# EAGLE design numi_clock (EAGLE 7.4.0)
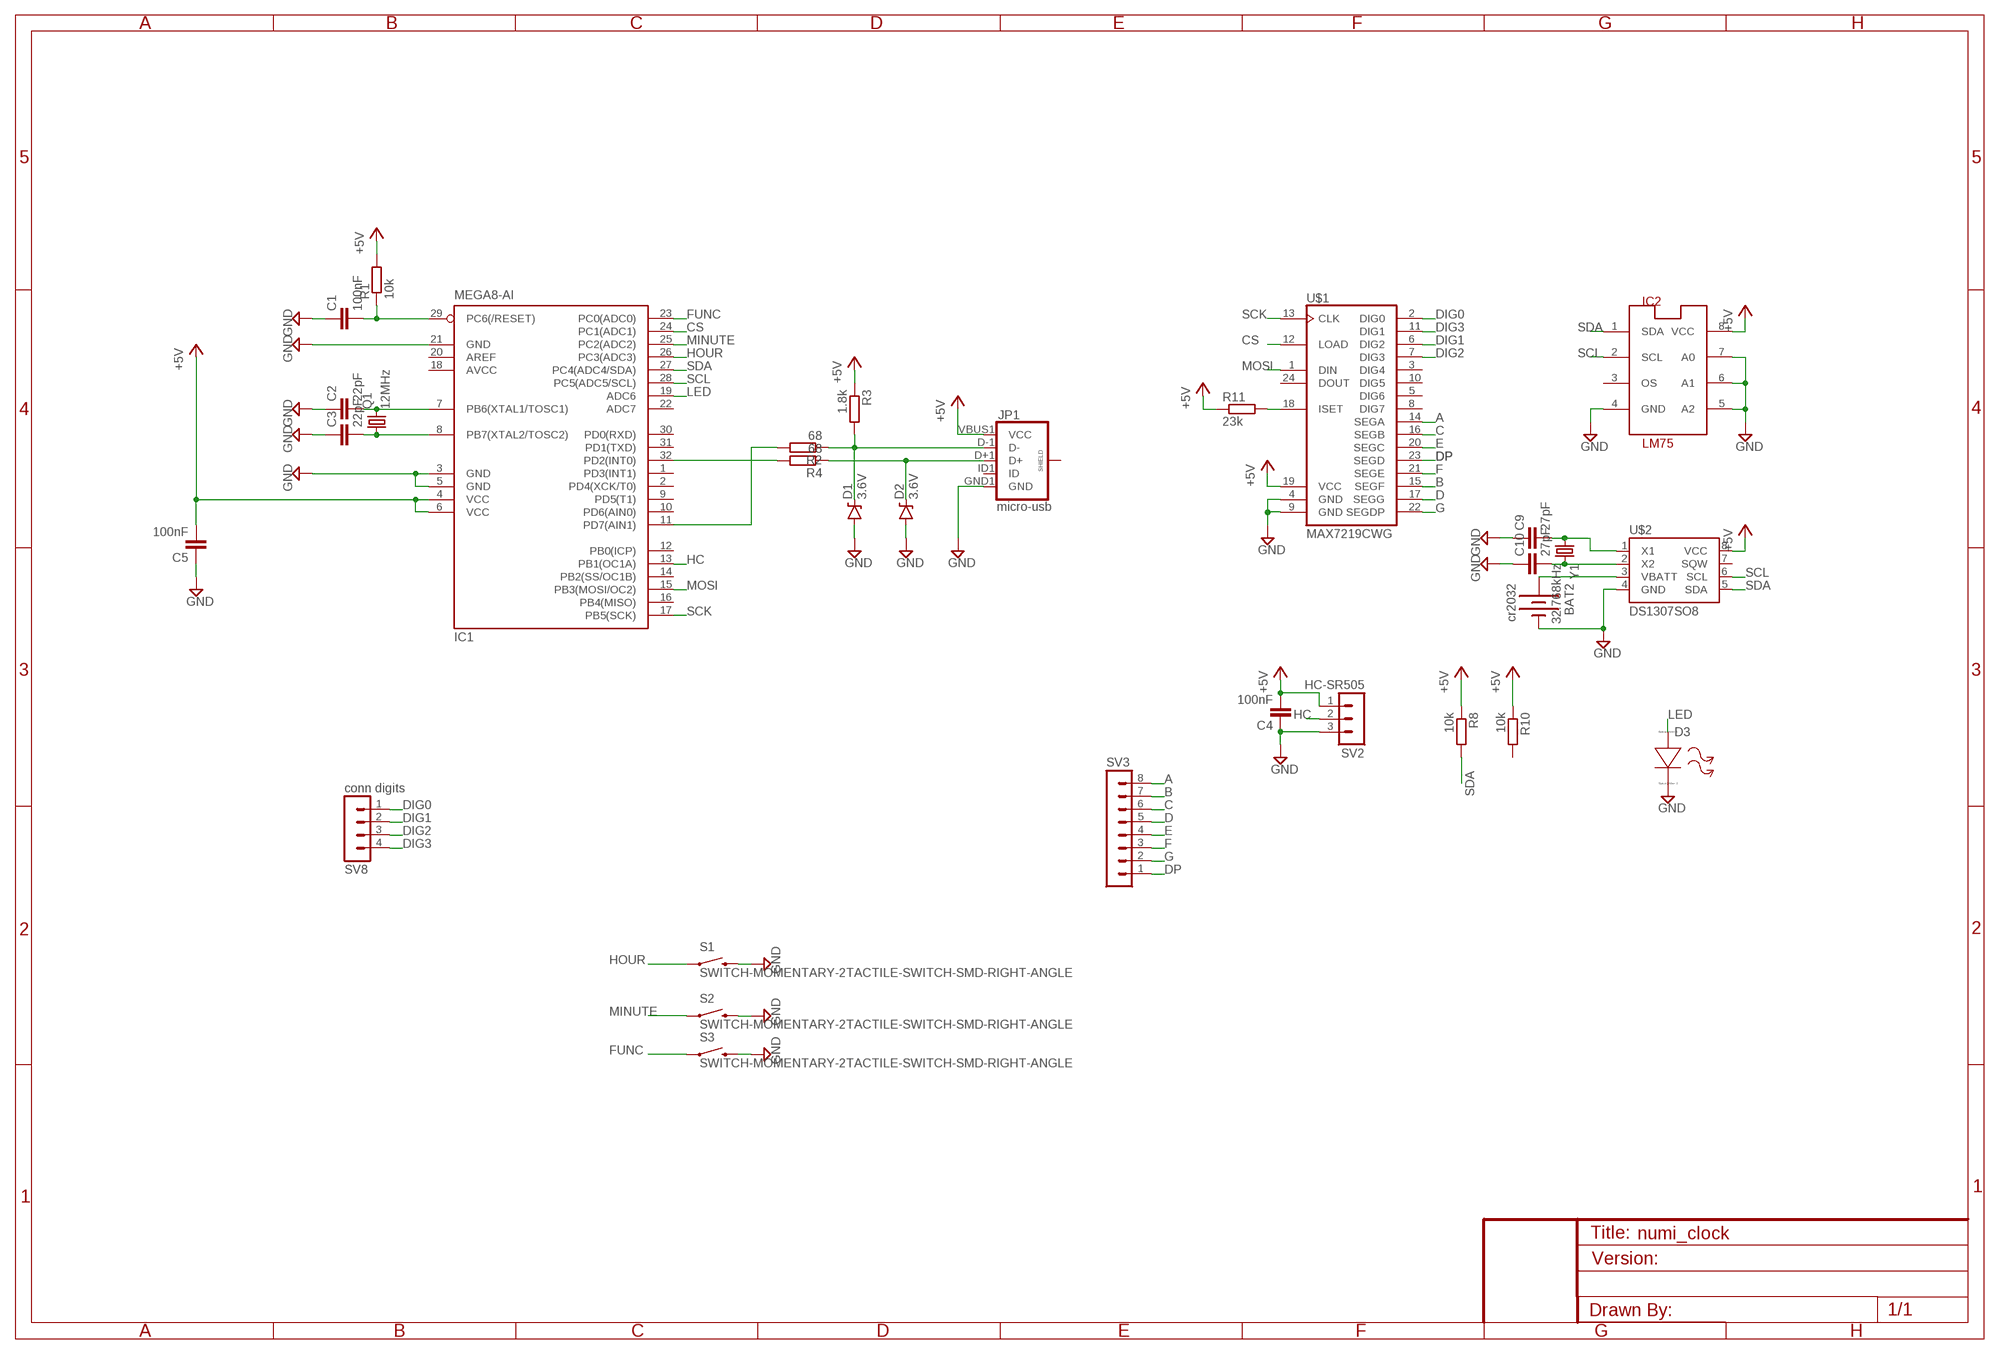
[diagram p0: schematic, sheet 1]

## Parts
BAT2  cr2032  BATTERY20PTH  [BATTCOM_20MM_PTH]
C1  100nF  C-EUC0805  [C0805]
C2  22pF  C-EUC0805  [C0805]
C3  22pF  C-EUC0805  [C0805]
C4  100nF  C-EUC0805  [C0805]
C5  100nF  C-EUC0805  [C0805]
C9  27pF  C-EUC0805  [C0805]
C10  27pF  C-EUC0805  [C0805]
D1  3.6V  DIODE-ZENER3.3V  [SOD-323]
D2  3.6V  DIODE-ZENER3.3V  [SOD-323]
D3  LED  [R0805]
IC1  MEGA8-AI  [TQFP32-08]
IC2  LM75  LM75_ICN  [SO8_LM75]
JP1  micro-usb  USB_MICROB_PLUGCONN-11752  [USB-B-MICRO-SMD_V03]
Q1  12MHz  CRYSTALCTS406  [CTS406]
R1  10k  R-EU_R0805  [R0805]
R2  68  R-EU_R0805  [R0805]
R3  1.8k  R-EU_R0805  [R0805]
R4  68  R-EU_R0805  [R0805]
R8  10k  R-EU_R0805  [R0805]
R10  10k  R-EU_R0805  [R0805]
R11  23k  R-EU_R0805  [R0805]
S1  SWITCH-MOMENTARY-2TACTILE-SWITCH-SMD-RIGHT-ANGLE  [TACTILE_SWITCH-SMD-RIGHT-ANGLE]
S2  SWITCH-MOMENTARY-2TACTILE-SWITCH-SMD-RIGHT-ANGLE  [TACTILE_SWITCH-SMD-RIGHT-ANGLE]
S3  SWITCH-MOMENTARY-2TACTILE-SWITCH-SMD-RIGHT-ANGLE  [TACTILE_SWITCH-SMD-RIGHT-ANGLE]
SV2  HC-SR505  MA03-1  [MA03-1]
SV3  MA08-1  [MA08-1]
SV8  conn digits  MA04-1  [MA04-1]
U$1  MAX7219CWG  [SO24L]
U$2  DS1307SO8  [SO08]
Y1  32.768kHz  CRYSTALTC26H  [TC26H]

## Nets
+5V: C4.2 C5.2 IC1.4(VCC) IC1.6(VCC) IC2.8(VCC) JP1.VBUS1(VCC) R1.2 R3.1 R8.1 R10.1 R11.1 SV2.1 U$1.19(VCC) U$2.8(VCC)
A: SV3.8 U$1.14(SEGA)
B: SV3.7 U$1.15(SEGF)
C: SV3.6 U$1.16(SEGB)
CS: IC1.24(PC1(ADC1)) U$1.12(LOAD)
D: SV3.5 U$1.17(SEGG)
DIG0: SV8.1 U$1.2(DIG0)
DIG1: SV8.2 U$1.6(DIG2)
DIG2: SV8.3 U$1.7(DIG3)
DIG3: SV8.4 U$1.11(DIG1)
DP: SV3.1 U$1.23(SEGD)
E: SV3.4 U$1.20(SEGC)
F: SV3.3 U$1.21(SEGE)
FUNC: IC1.23(PC0(ADC0)) S3.1
G: SV3.2 U$1.22(SEGDP)
GND: BAT2.2(-) C1.1 C2.1 C3.1 C4.1 C5.1 C9.1 C10.1 D1.A D2.A D3.2(-) IC1.3(GND) IC1.5(GND) IC1.21(GND) IC2.4(GND) IC2.5(A2) IC2.6(A1) IC2.7(A0) JP1.GND1(GND) S1.2 S2.2 S3.2 SV2.3 U$1.4(GND) U$1.9(GND) U$2.4(GND)
HC: IC1.13(PB1(OC1A)) SV2.2
HOUR: IC1.26(PC3(ADC3)) S1.1
LED: D3.1(+) IC1.19(ADC6)
MINUTE: IC1.25(PC2(ADC2)) S2.1
MOSI: IC1.15(PB3(MOSI/OC2)) U$1.1(DIN)
N$1: C2.2 IC1.7(PB6(XTAL1/TOSC1)) Q1.3
N$2: C3.2 IC1.8(PB7(XTAL2/TOSC2)) Q1.1
N$3: R11.2 U$1.18(ISET)
N$4: C9.2 U$2.1(X1) Y1.1
N$5: C10.2 U$2.2(X2) Y1.2
N$6: BAT2.1(+) U$2.3(VBATT)
N$7: D2.C JP1.D+1(D+) R4.1
N$8: D1.C JP1.D-1(D-) R2.1 R3.2
N$9: IC1.32(PD2(INT0)) R4.2
N$10: IC1.11(PD7(AIN1)) R2.2
RESET: C1.2 IC1.29(PC6(/RESET)) R1.1
SCK: IC1.17(PB5(SCK)) U$1.13(CLK)
SCL: IC1.28(PC5(ADC5/SCL)) IC2.2(SCL) U$2.6(SCL)
SDA: IC1.27(PC4(ADC4/SDA)) IC2.1(SDA) R8.2 U$2.5(SDA)
Unconnected: IC1.1(PD3(INT1)) IC1.2(PD4(XCK/T0)) IC1.9(PD5(T1)) IC1.10(PD6(AIN0)) IC1.12(PB0(ICP)) IC1.14(PB2(SS/OC1B)) IC1.16(PB4(MISO)) IC1.20(AREF) IC1.22(ADC7) IC1.30(PD0(RXD)) IC1.31(PD1(TXD)) IC2.3(OS) JP1.ID1(ID) JP1.SHIELD1(SHIELD) JP1.SHIELD2(SHIELD) JP1.SHIELD3(SHIELD) R10.2 U$1.3(DIG4) U$1.5(DIG6) U$1.8(DIG7) U$1.10(DIG5) U$1.24(DOUT) U$2.7(SQW)

## Power pins joined to a net without a drawn wire
AVCC: IC1.18(AVCC)

## Library data of the parts
BAT2 = SparkFun:BATTERY: Battery Holders Various common sizes : AA, AAA, 20mm coin cell and 12mm coin cell.
C1-C5 C9 C10 = rcl:C-EU: CAPACITOR, European symbol
D1 D2 = SparkFun-DiscreteSemi:DIODE-ZENER: Zener Diode Production Part - 8199 3.4V Zener Voltage; PROD_ID: DIO-11284; VALUE: 3.3V
D3 = sym:LED: Light Emitting Diode; SPICEMODEL: NONE; SPICETYPE: diode
IC1 = atmel:MEGA8: MICROCONTROLLER 8 Kbytes FLASH, 1 kbytes SRAM, 512 bytes EEPROM, USART, 6-channel 10 bit ADC, 2-channel 8 bit ADC Pin compatible with Atmega48, ATMega88, ATMega168 Source: avr.lbr; MPN: ATMEGA8-16AU; OC_FARNELL: 9171371; OC_NEWARK: 73M8863
IC2 = lm75:LM75_IC: Temperatursensor
JP1 = SparkFun-Connectors:USB_MICROB_PLUG: USB Micro-B connectors Some male, some female. Watch your step!; PROD_ID: CONN-11752
Q1 = crystal:CRYSTAL: CRYSTAL; OC_FARNELL: unknown; OC_NEWARK: unknown
R1-R4 R8 R10 R11 = rcl:R-EU_: RESISTOR, European symbol
S1-S3 = SparkFun-Electromechanical:SWITCH-MOMENTARY-2: Various NO switches- pushbuttons, reed, etc; PROD_ID: COMP-12265
SV2 = con-lstb:MA03-1: PIN HEADER; OC_FARNELL: unknown; OC_NEWARK: unknown
SV3 = con-lstb:MA08-1: PIN HEADER; OC_FARNELL: unknown; OC_NEWARK: unknown
SV8 = con-lstb:MA04-1: PIN HEADER; OC_FARNELL: unknown; OC_NEWARK: unknown
U$1 = max7219:MAX7219CWG
U$2 = SparkFun-FreqCtrl:DS1307: I2C real-time clock with battery backup.
Y1 = SparkFun-FreqCtrl:CRYSTAL: Various standard crystals. Proven footprints.; PROD_ID: XTAL-10112

## Board
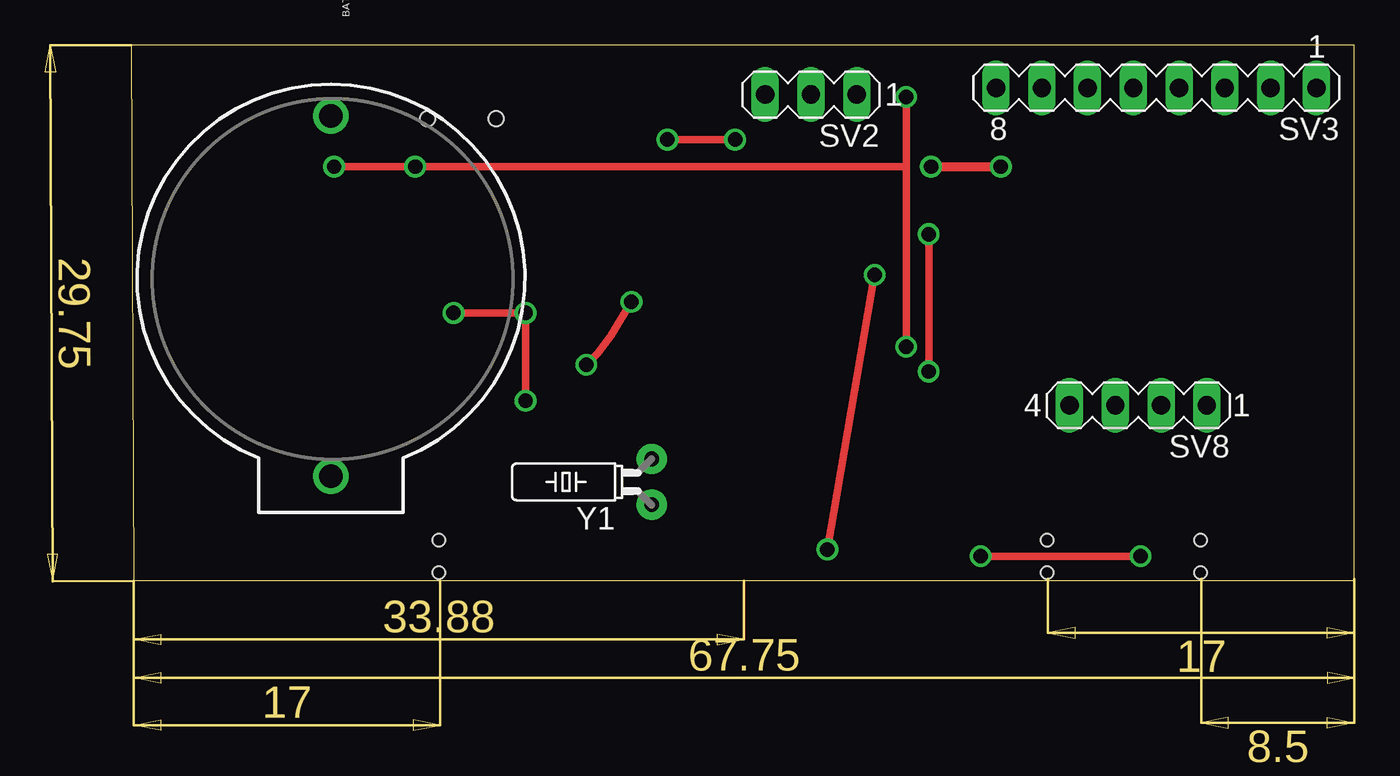
[diagram p1: board, top side]
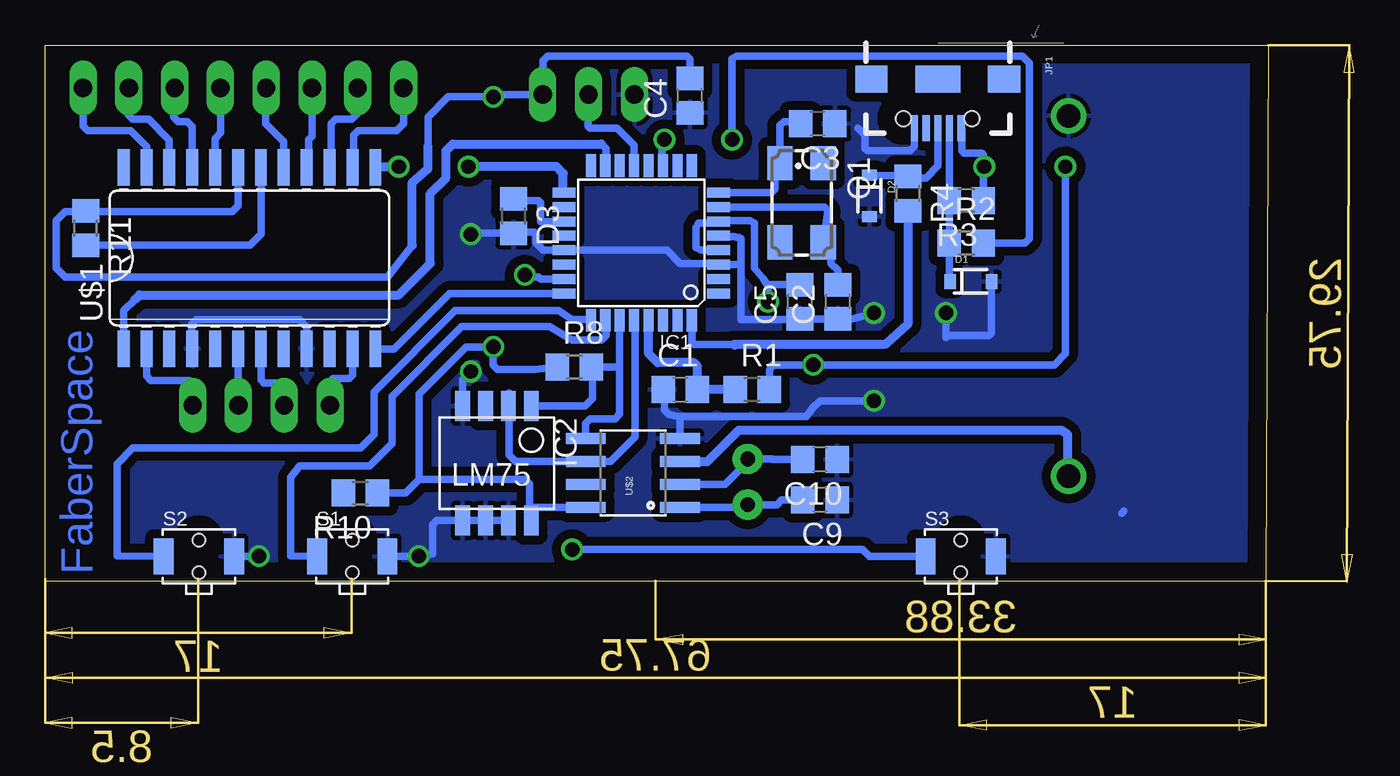
[diagram p2: board, bottom side, seen from below]

Size 67.88 x 29.75 mm. Coordinates in mm from the lower left corner, seen from the top.
Outline: 67.88,0 67.88,29.75 0,29.75 0.12,0 67.88,0
Copper layers (1*16): Top 0.035mm / dielectric 1.5mm / Bottom 0.035mm
Design rules "default": minimum track width 10mil, minimum drill 24mil, track to track 8mil, track to pad 8mil, pad to pad 8mil, via to via 8mil, smd to smd 8mil, copper to edge 40mil, drill to drill 8mil, minimum pad ring 10mil, minimum via ring 8mil, stop-mask expansion 4mil, vias tented up to drill 0mil, thermal gap 10mil

### Footprints (pad centres in the part's own frame; a part is rotated, then mirrored left to right if it is on the bottom)
BATTCOM_20MM_PTH = drill 1.3: 1 20,0; 2 0,0
C0805 = smd 1.3 x 1.5: 1 -0.95,0; 2 0.95,0
SOD-323 = smd 0.63 x 0.83: A 1.15,0; C -1.15,0
R0805 = smd 1.3 x 1.5: 1 -0.95,0; 2 0.95,0
TQFP32-08 = smd 1.27 x 0.559: 1 -4.293,2.8; 2 -4.293,2; 3 -4.293,1.2; 4 -4.293,0.4; 5 -4.293,-0.4; 6 -4.293,-1.2; 7 -4.293,-2; 8 -4.293,-2.8; 17 4.293,-2.8; 18 4.293,-2; 19 4.293,-1.2; 20 4.293,-0.4; 21 4.293,0.4; 22 4.293,1.2; 23 4.293,2; 24 4.293,2.8 | smd 0.559 x 1.27: 9 -2.8,-4.293; 10 -2,-4.293; 11 -1.2,-4.293; 12 -0.4,-4.293; 13 0.4,-4.293; 14 1.2,-4.293; 15 2,-4.293; 16 2.8,-4.293; 25 2.8,4.293; 26 2,4.293; 27 1.2,4.293; 28 0.4,4.293; 29 -0.4,4.293; 30 -1.2,4.293; 31 -2,4.293; 32 -2.8,4.293
SO8_LM75 = smd 0.813 x 1.676: 1 -1.27,-3.175; 2 0,-3.175; 3 1.27,-3.175; 4 2.54,-3.175; 5 2.54,3.175; 6 1.27,3.175; 7 0,3.175; 8 -1.27,3.175
USB-B-MICRO-SMD_V03 = smd 1.45 x 0.4: D+1 2.725,0; D-1 2.725,0.65; GND1 2.725,-1.3; ID1 2.725,-0.65; VBUS1 2.725,1.3 | smd 1.5 x 1.8: SHIELD1 0,3.685; SHIELD2 0,-3.685 | smd 1.5 x 2.5: SHIELD3 0,0 | hole 0.85: 2.2,1.9; 2.2,-1.9
CTS406 = smd 1.9 x 1.4: 1 -2.2,-1.2; 2 2.2,-1.2; 3 2.2,1.2; 4 -2.2,1.2
TACTILE_SWITCH-SMD-RIGHT-ANGLE = smd 1.1 x 2: 1 -1.95,0; 2 1.95,0 | hole 0.7: 0,0.9; 0,-0.9
MA03-1 = drill 1.016 long: 1 -2.54,0; 2 0,0; 3 2.54,0
MA08-1 = drill 1.016 long: 1 -8.89,0; 2 -6.35,0; 3 -3.81,0; 4 -1.27,0; 5 1.27,0; 6 3.81,0; 7 6.35,0; 8 8.89,0
MA04-1 = drill 1.016 long: 1 -3.81,0; 2 -1.27,0; 3 1.27,0; 4 3.81,0
SO24L = smd 0.66 x 2.032: 1 -6.985,-5.029; 2 -5.715,-5.029; 3 -4.445,-5.029; 4 -3.175,-5.029; 5 -1.905,-5.029; 6 -0.635,-5.029; 7 0.635,-5.029; 8 1.905,-5.029; 9 3.175,-5.029; 10 4.445,-5.029; 11 5.715,-5.029; 12 6.985,-5.029; 13 6.985,5.029; 14 5.715,5.029; 15 4.445,5.029; 16 3.175,5.029; 17 1.905,5.029; 18 0.635,5.029; 19 -0.635,5.029; 20 -1.905,5.029; 21 -3.175,5.029; 22 -4.445,5.029; 23 -5.715,5.029; 24 -6.985,5.029
SO08 = smd 0.61 x 2.21: 1 -1.905,-2.616; 2 -0.635,-2.616; 3 0.635,-2.616; 4 1.905,-2.616; 5 1.905,2.616; 6 0.635,2.616; 7 -0.635,2.616; 8 -1.905,2.616
TC26H = drill 0.813 pad 1.676: 1 -1.27,0; 2 1.27,0

### Placement (x,y rotation side)
BAT2  11.07,25.81 270 top
C1  32.62,10.62 0 bottom
C2  23.88,15.5 90 bottom
C3  25,25.38 180 bottom
C4  32.09,26.94 90 bottom
C5  25.98,15.5 90 bottom
C9  24.88,4.5 180 bottom
C10  24.88,6.75 180 bottom
D1  16.5,16.62 0 bottom
D2  22.12,21.38 270 bottom
D3  41.88,20.25 270 bottom
IC1  34.78,18.76 180 bottom
IC2  42.16,6.54 180 bottom
JP1  18.33,27.85 270 bottom
Q1  25.88,21 270 bottom
R1  28.62,10.62 0 bottom
R2  16.75,18.75 0 bottom
R3  16.75,21.12 180 bottom
R4  20,21.5 270 bottom
R8  38.5,11.88 0 bottom
R10  50.38,4.88 180 bottom
R11  65.63,19.59 270 bottom
S1  50.83,1.37 0 bottom
S2  59.33,1.37 0 bottom
S3  17.05,1.37 0 bottom
SV2  37.72,27 180 top
SV3  56.88,27.38 180 top
SV8  55.88,9.75 180 top
U$1  56.53,17.93 0 bottom
U$2  35.25,6 90 bottom
Y1  28.88,5.5 90 top

### Tracks (layer width: path | path; a pad name or v marks a point on that pad's centre or on a via)
+5V  (via drill 0.8)
  Top 0.406: v25.25,12 25.88,12.62 26.62,13.62 v27.75,15.5 | v43,13 43,23.12 | 43,23.12 v43,26.88 | 43,23.12 42.88,23 v15.75,23 v11.25,23
  Bottom 0.406: IC1.4 31.48,18.36 31.75,18.5 31.75,19.62 31.62,19.88 30.58,19.88 IC1.6 30.45,20 28.75,20 28.5,19.88 28.5,17.38 28,16.75 27.75,16.38 | U$1.19 57.17,20.84 57.5,20.5 65.59,20.5 | 65.59,20.5 66.75,20.5 67.25,20 67.25,17.38 66.75,16.88 48.88,16.88 47.5,18.62 | 65.59,20.5 R11.1 | R1.2 27.67,11.7 27.5,12 v25.25,12 11.88,12 11.25,12.62 v11.25,23 | 27.75,16.38 27.7,16.45 C5.2 | v27.75,15.5 27.75,16.38 | 47.12,5.62 47.12,10.38 44.5,13 v43,13 43,12 42.75,11.75 40.7,11.75 R8.1 | U$2.8 40.87,4.1 IC2.8 40.99,4.12 41,4.12 41,5.38 41.25,5.62 47.12,5.62 | 43.12,27 v43,26.88 | v43,26.88 42.88,27 SV2.1 40.25,28.88 40,29.12 32.25,29.12 32.09,28.97 C4.2 | v43,26.88 45.5,26.88 46.62,25.75 46.62,24.12 | R10.1 47.88,4.88 47.12,5.62 | R3.1 15.8,22.95 | 15.8,22.95 v15.75,23 | 15.8,22.95 15.8,23.68 15.88,23.75 16.88,23.75 17,23.88 17,25.1 JP1.VBUS1
  Bottom 0.5: 47.5,18.62 47.5,22.12 46.62,22.88 46.62,24.12
A
  Bottom 0.406: SV3.8 47.98,25.39 48.38,25 50.5,25 50.75,24.75 50.75,23.02 U$1.14
B
  Bottom 0.406: SV3.7 50.53,25.98 50.88,25.62 51.75,25.62 52,25.38 52,23.04 U$1.15
C
  Bottom 0.406: SV3.6 53.06,24.69 53.25,24.5 53.25,23.06 U$1.16
CS
  Bottom 0.406: 39.12,16 IC1.24 45.41,15.96 48.5,12.88 49.44,12.88 U$1.12
  Bottom 0.5: U$1.12 49.5,12.82
D
  Bottom 0.406: U$1.17 54.62,24.38 55.62,25.38 55.62,27.48 SV3.5
DIG0
  Bottom 0.406: SV8.1 59.75,9.57 59.75,11 59.88,11.12 62,11.12 62.25,11.37 U$1.2
DIG1
  Bottom 0.406: SV8.2 57.17,9.52 U$1.6
DIG2
  Bottom 0.406: SV8.3 54.62,9.52 54.62,10.75 54.88,11 55.75,11 55.89,11.14 U$1.7
DIG3
  Bottom 0.406: SV8.4 52.12,9.56 52.12,11 51.88,11.25 51,11.25 50.81,11.43 U$1.11
DP
  Bottom 0.406: U$1.23 62.25,24.12 63.12,25 65.5,25 65.75,25.25 65.75,27.48 SV3.1
E
  Bottom 0.406: U$1.20 58.44,24.56 58.12,24.88 58.12,27.48 SV3.4
F
  Bottom 0.406: U$1.21 59.7,25.2 60,25.5 60.5,25.5 60.75,25.75 60.75,27.44 SV3.3
FUNC  (via drill 0.8)
  Top 0.406: v41.25,17 v38.62,1.75
  Bottom 0.406: IC1.23 40.37,16.76 40.38,16.75 40.5,16.88 41.12,16.88 v41.25,17 | S3.1 22.12,1.37 22.5,1.75 v38.62,1.75
G
  Bottom 0.406: U$1.22 60.97,24.48 62.12,25.62 63,25.62 63.25,25.88 63.25,27.48 SV3.2
GND  (via drill 0.8)
  Top 0.406: v21.88,10 v21.88,14.88 v17.88,14.88 | v56,1.38 v47.12,1.38 | v44.25,11.62 v44.25,19.25
  Bottom 0.406: 53.38,12.79 U$1.9 53.36,14.11 53.75,14.5 59.5,14.5 59.75,14.25 59.75,12.82 U$1.4 | IC2.7 IC2.6 IC2.5 46.13,3.37 46.38,3.12 46.38,1.5 v47.12,1.38 49.12,1.37 S1.2 | C1.1 33.5,10.62 33.5,9.5 33.25,9.25 32.75,9.12 | 32.75,9.12 25.62,9.12 25.25,9.62 24.88,10 v21.88,10 | v21.88,14.88 23.7,14.38 C2.1 C5.1 25.9,14.5 29.25,14.5 29.25,17.62 | 29.25,17.62 29.56,17.56 IC1.3 30.56,17.62 32.62,17.62 33.36,18.36 IC1.21 40.23,18.36 40.62,18.75 40.62,19.25 40.75,19.38 41.8,19.38 D3.2 44.2,19.3 v44.25,19.25 | 29.25,17.62 29.25,19 29.62,19.12 30.46,19.12 IC1.5 | U$2.4 32.63,9.13 32.75,9.12 | 8.12,3.75 8,3.88 | 57.25,1.38 v56,1.38 | 44.75,9.71 IC2.4 44.7,11.18 v44.25,11.62 | JP1.GND1 19.63,24.13 19.62,24.12 19.88,23.88 22.25,23.88 22.38,24 22.38,24.75 22.75,25.12 | D1.A 15.35,13.77 15.5,13.62 17.75,13.62 17.88,13.5 v17.88,14.88
  pour Bottom (isolate 0.5): 0.12,29.75 67.88,29.75 67.88,0.12 0.12,0.12
HC
  Bottom 0.406: IC1.13 35.19,24.19 36.12,25.12 37.62,25.12 37.75,25.25 37.75,26.97 SV2.2
HOUR
  Bottom 0.406: IC1.26 36.75,14.43 36.75,13.62 37,13.38 38.62,13.38 39.88,14.12 44.75,14.12 48.62,10.25 48.62,7.62 49.88,6.38 53.75,6.38 54.25,5.75 54.25,1.39 S1.1
LED
  Bottom 0.406: IC1.19 40.38,19.96 40.38,21 40.5,21.12 41.8,21.12 D3.1
MINUTE
  Bottom 0.406: 37.62,14.5 38.62,14.5 39.38,15 45.12,15 49.62,10.5 49.62,8.12 50.38,7.38 63,7.38 63.88,6.5 63.88,1.4 S2.1
  Bottom 0.5: 37.62,14.5 IC1.25
MOSI
  Bottom 0.406: U$1.1 63.5,12.79 63.5,15 62.88,15.62 | IC1.15 36.75,23.09 36.75,24 37,24.25
  Bottom 0.5: 62.88,15.62 62.62,15.88 48.25,15.88 46.5,17.62 46.5,21.5 45.62,22.38 45.62,23.88 45.25,24.25 37,24.25
N$1
  Bottom 0.406: IC1.7 24.62,20.75 24.44,20.56 Q1.3 24.25,18.73 24.25,17.62 23.88,17.25 C2.2
N$2
  Bottom 0.406: IC1.8 27.56,21.56 27.38,21.75 27.38,22.91 Q1.1 27.09,25.29 26.88,25.5 26.08,25.5 C3.2
N$3
  Bottom 0.406: R11.2 56.49,18.64 55.88,19.25 55.88,22.81 U$1.18
N$4
  Bottom 0.406: U$2.1 29.01,4.1 Y1.1 27.27,4.23 27,4.5 C9.2
N$5
  Bottom 0.406: U$2.2 30.13,5.37 29.12,6.38 29.12,6.52 Y1.2 27.52,6.77 27.5,6.75 C10.2
N$6
  Bottom 0.5: U$2.3 32.5,6.62 31.12,6.62 29.38,8.38 11.5,8.38 11.12,8.12 11.12,5.87 BAT2.1
N$7
  Bottom 0.406: D2.C 22.1,22.5 20.5,22.5 20.45,22.45 R4.1 19.92,22.38 19,22.38 18.33,23.05 JP1.D+1
N$8
  Bottom 0.406: D1.C 17.7,17.02 R2.1 R3.2 17.7,23.61 JP1.D-1
N$9
  Bottom 0.406: IC1.32 31.98,13.23 31.88,13.12 29.62,13.12
  Bottom 0.5: 29,13.12 29.59,13.09 | R4.2 20,14.25 21.25,13.12 29,13.12 | 29,13.12 29.62,13.12
N$10  (via drill 0.8)
  Top 0.406: v29.75,24.5 v33.5,24.5
  Bottom 0.406: R2.2 13.5,18.75 13.25,19 13.25,28.75 13.62,29.12 29.5,29.12 29.75,29 v29.75,24.5 | 33.62,23.09 33.62,24.38 v33.5,24.5
  Bottom 0.5: IC1.11 33.62,23.09
RESET
  Bottom 0.5: R1.1 C1.2 31.67,11.93 31.88,12.12 33.88,12.12 34.38,12.62 34.38,14.46 IC1.29
SCK  (via drill 0.8)
  Top 0.5: v44.38,23 v48.25,23
  Bottom 0.406: U$1.13
  Bottom 0.5: IC1.17 39.12,21.61 39.12,22.62 39.5,23 v44.38,23 | U$1.13 49.37,23 v48.25,23
SCL
  Bottom 0.406: IC1.28 35.12,14.41 35.12,8 36.49,6.63 U$2.6 41.76,6.63 42.12,7 42.12,10.43 IC2.2
SDA
  Bottom 0.406: IC1.27 35.98,12 | 35.98,12 35.98,9.27 36.25,9 37.62,9 37.88,8.75 37.88,7.91 U$2.5 | 35.98,12 36.11,11.88 R8.2 37.5,11.82 37.5,10.12 37.91,9.71 IC2.1

### Text on the board
Bottom: FaberSpace